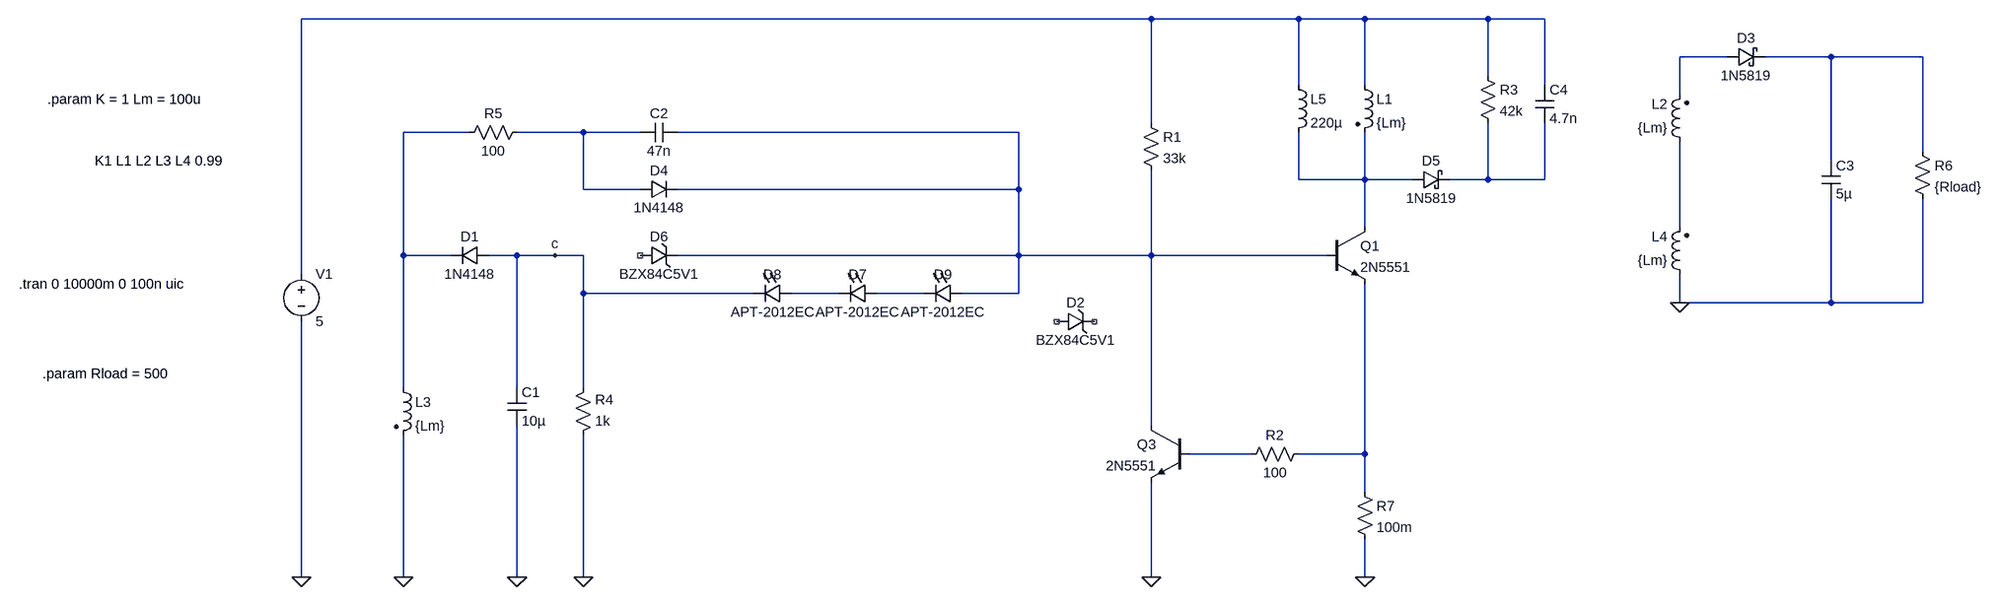
[diagram p0: schematic self_flyback_v2.asc]
self_flyback_v2.asc, the LTspice schematic file:
Version 4
SHEET 1 2476 1060
WIRE 448 -256 -1072 -256
WIRE 704 -256 448 -256
WIRE 816 -256 704 -256
WIRE 1024 -256 816 -256
WIRE 1120 -256 1024 -256
WIRE 1568 -192 1488 -192
WIRE 1744 -192 1632 -192
WIRE 2112 -192 1744 -192
WIRE 1024 -160 1024 -256
WIRE 704 -144 704 -256
WIRE 816 -144 816 -256
WIRE 1120 -144 1120 -256
WIRE 1488 -128 1488 -192
WIRE 448 -80 448 -256
WIRE -704 -64 -816 -64
WIRE -512 -64 -624 -64
WIRE -416 -64 -512 -64
WIRE 224 -64 -352 -64
WIRE 2112 -32 2112 -192
WIRE 1744 -16 1744 -192
WIRE 704 16 704 -64
WIRE 816 16 816 -64
WIRE 816 16 704 16
WIRE 896 16 816 16
WIRE 1024 16 1024 -80
WIRE 1024 16 960 16
WIRE 1120 16 1120 -80
WIRE 1120 16 1024 16
WIRE -512 32 -512 -64
WIRE -416 32 -512 32
WIRE 224 32 224 -64
WIRE 224 32 -352 32
WIRE 816 96 816 16
WIRE 1488 96 1488 -48
WIRE -816 144 -816 -64
WIRE -736 144 -816 144
WIRE -624 144 -672 144
WIRE -560 144 -624 144
WIRE -512 144 -560 144
WIRE 224 144 224 32
WIRE 224 144 -352 144
WIRE 448 144 448 0
WIRE 448 144 224 144
WIRE 752 144 448 144
WIRE -1072 176 -1072 -256
WIRE -512 208 -512 144
WIRE -224 208 -512 208
WIRE -80 208 -160 208
WIRE 64 208 -16 208
WIRE 224 208 224 144
WIRE 224 208 128 208
WIRE 1488 224 1488 176
WIRE 1744 224 1744 48
WIRE 1744 224 1488 224
WIRE 2112 224 2112 48
WIRE 2112 224 1744 224
WIRE -816 368 -816 144
WIRE -624 368 -624 144
WIRE -512 368 -512 208
WIRE 448 432 448 144
WIRE 624 480 512 480
WIRE 816 480 816 192
WIRE 816 480 704 480
WIRE 816 544 816 480
WIRE -1072 688 -1072 256
WIRE -816 688 -816 448
WIRE -624 688 -624 432
WIRE -512 688 -512 448
WIRE 448 688 448 528
WIRE 816 688 816 624
FLAG 448 688 0
FLAG -624 688 0
FLAG -1072 688 0
FLAG 1488 224 0
FLAG -560 144 c
FLAG 816 688 0
FLAG -816 688 0
FLAG -512 688 0
SYMBOL npn 752 96 R0
SYMATTR InstName Q1
SYMATTR Value 2N5551
SYMBOL res 432 -96 R0
SYMATTR InstName R1
SYMATTR Value 33k
SYMBOL res 720 464 R90
WINDOW 0 0 56 VBottom 2
WINDOW 3 32 56 VTop 2
SYMATTR InstName R2
SYMATTR Value 100
SYMBOL voltage -1072 160 R0
WINDOW 123 0 0 Left 0
WINDOW 39 0 0 Left 0
SYMATTR InstName V1
SYMATTR Value 5
SYMBOL ind2 800 -160 R0
SYMATTR InstName L1
SYMATTR Value {Lm}
SYMATTR Type ind
SYMBOL ind2 1504 -32 R180
WINDOW 0 36 80 Left 2
WINDOW 3 36 40 Left 2
SYMATTR InstName L2
SYMATTR Value {Lm}
SYMATTR Type ind
SYMBOL ind2 -832 352 R0
SYMATTR InstName L3
SYMATTR Value {Lm}
SYMATTR Type ind
SYMBOL diode -672 128 R90
WINDOW 0 0 32 VBottom 2
WINDOW 3 32 32 VTop 2
SYMATTR InstName D1
SYMATTR Value 1N4148
SYMBOL zener 288 272 R270
WINDOW 0 32 32 VTop 2
WINDOW 3 0 32 VBottom 2
SYMATTR InstName D2
SYMATTR Value BZX84C5V1
SYMATTR Description Diode
SYMATTR Type diode
SYMBOL cap -640 368 R0
SYMATTR InstName C1
SYMATTR Value 10µ
SYMBOL cap -352 -80 R90
WINDOW 0 0 32 VBottom 2
WINDOW 3 32 32 VTop 2
SYMATTR InstName C2
SYMATTR Value 47n
SYMBOL res -720 -48 R270
WINDOW 0 32 56 VTop 2
WINDOW 3 0 56 VBottom 2
SYMATTR InstName R5
SYMATTR Value 100
SYMBOL res 2096 -48 R0
SYMATTR InstName R6
SYMATTR Value {Rload}
SYMBOL cap 1728 -16 R0
SYMATTR InstName C3
SYMATTR Value 5µ
SYMBOL res 800 528 R0
SYMATTR InstName R7
SYMATTR Value 100m
SYMBOL res -528 464 M180
WINDOW 0 36 76 Left 2
WINDOW 3 36 40 Left 2
SYMATTR InstName R4
SYMATTR Value 1k
SYMBOL diode -416 48 R270
WINDOW 0 32 32 VTop 2
WINDOW 3 0 32 VBottom 2
SYMATTR InstName D4
SYMATTR Value 1N4148
SYMBOL cap 1104 -144 R0
SYMATTR InstName C4
SYMATTR Value 4.7n
SYMBOL res 1008 -176 R0
SYMATTR InstName R3
SYMATTR Value 42k
SYMBOL schottky 1568 -176 R270
WINDOW 0 32 32 VTop 2
WINDOW 3 0 32 VBottom 2
SYMATTR InstName D3
SYMATTR Value 1N5819
SYMATTR Description Diode
SYMATTR Type diode
SYMBOL ind 688 -160 R0
SYMATTR InstName L5
SYMATTR Value 220µ
SYMBOL ind2 1504 192 R180
WINDOW 0 36 80 Left 2
WINDOW 3 36 40 Left 2
SYMATTR InstName L4
SYMATTR Value {Lm}
SYMATTR Type ind
SYMBOL schottky 896 32 R270
WINDOW 0 32 32 VTop 2
WINDOW 3 0 32 VBottom 2
SYMATTR InstName D5
SYMATTR Value 1N5819
SYMATTR Description Diode
SYMATTR Type diode
SYMBOL npn 512 432 M0
SYMATTR InstName Q3
SYMATTR Value 2N5551
SYMBOL zener -416 160 R270
WINDOW 0 32 32 VTop 2
WINDOW 3 0 32 VBottom 2
SYMATTR InstName D6
SYMATTR Value BZX84C5V1
SYMATTR Description Diode
SYMATTR Type diode
SYMBOL LED -16 192 R90
WINDOW 0 0 32 VBottom 2
WINDOW 3 32 32 VTop 2
SYMATTR InstName D7
SYMATTR Value APT-2012EC
SYMATTR Description Diode
SYMATTR Type diode
SYMBOL LED -160 192 R90
WINDOW 0 0 32 VBottom 2
WINDOW 3 32 32 VTop 2
SYMATTR InstName D8
SYMATTR Value APT-2012EC
SYMATTR Description Diode
SYMATTR Type diode
SYMBOL LED 128 192 R90
WINDOW 0 0 32 VBottom 2
WINDOW 3 32 32 VTop 2
SYMATTR InstName D9
SYMATTR Value APT-2012EC
SYMATTR Description Diode
SYMATTR Type diode
TEXT -1856 192 Left 2 !.tran 0 10000m 0 100n uic
TEXT -1728 -16 Left 2 !K1 L1 L2 L3 L4 0.99
TEXT -1808 -120 Left 2 !.param K = 1 Lm = 100u
TEXT -1816 344 Left 2 !.param Rload = 500

The netlist it stands for:
* self_flyback_v2.asc
Q1 N007 N006 N013 0 2N5551
R1 N001 N006 33k
R2 N013 N012 100
V1 N001 0 5
L1 N001 N007 {Lm}
L2 N009 N002 {Lm}
L3 N004 0 {Lm}
D1 c N004 1N4148
D2 NC_01 NC_02 BZX84C5V1
C1 c 0 10µ
C2 N006 N005 47n
R5 N004 N005 100
R6 N003 0 {Rload}
C3 N003 0 5µ
R7 N013 0 100m
R4 0 c 1k
D4 N005 N006 1N4148
C4 N001 N008 4.7n
R3 N001 N008 42k
D3 N002 N003 1N5819
L5 N001 N007 220µ
L4 0 N009 {Lm}
D5 N007 N008 1N5819
Q3 N006 N012 0 0 2N5551
D6 NC_03 N006 BZX84C5V1
D7 N011 N010 APT-2012EC
D8 N010 c APT-2012EC
D9 N006 N011 APT-2012EC
.model D D
.lib standard.dio
.model NPN NPN
.model PNP PNP
.lib standard.bjt
.tran 0 10000m 0 100n uic
K1 L1 L2 L3 L4 0.99
.param K = 1 Lm = 100u
.param Rload = 500
.backanno
.end